# Altium project ESP32_DEV.PrjPcb
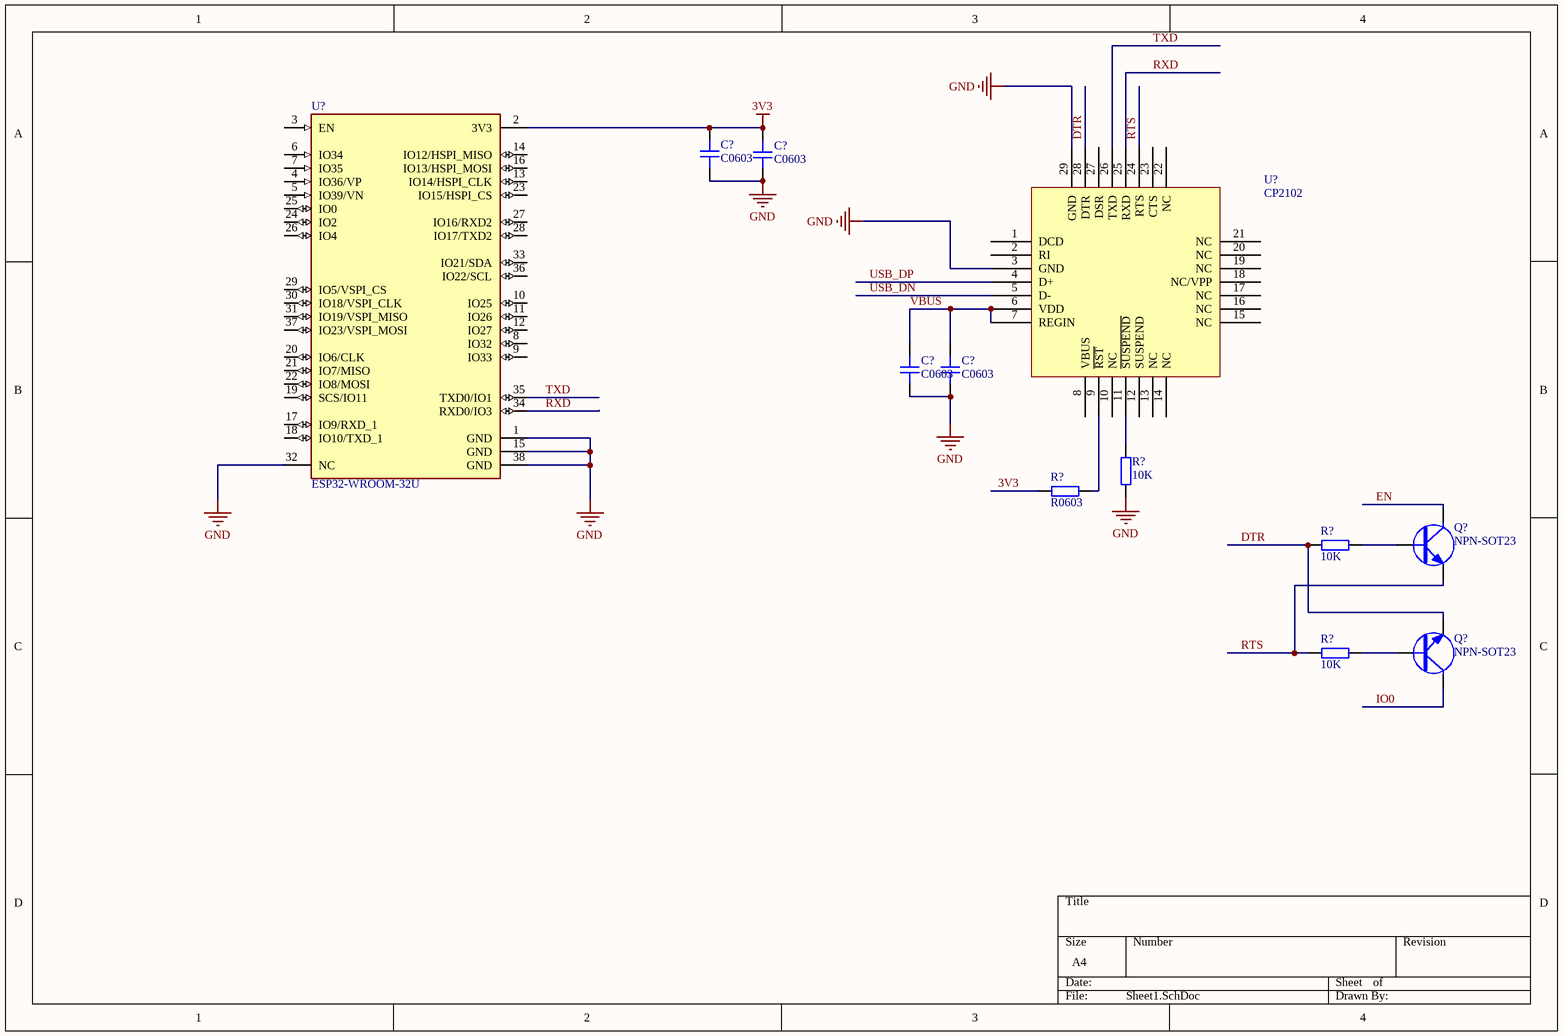
[diagram p0: Sheet1.SchDoc]
1 sheet, 12 parts. Net scope: global (net labels, ports and power ports of the same name join across sheets).
Board file: PCB1.PcbDoc

## Sheet Sheet1.SchDoc
size A4; SheetNumber: 1; SheetTotal: 1

### Parts
(Parts that share a designator on the sheet are numbered #1, #2 ... from top to bottom, then left to right.)
C?#1  C0603  [CAP_0603]
C?#2  C0603  [CAP_0603]
C?#3  C0603  [CAP_0603]
C?#4  C0603  [CAP_0603]
Q?#1  NPN-SOT23  [SOT23 - 3PIN]
Q?#2  NPN-SOT23  [SOT23 - 3PIN]
R?#1  10K  [RES_0603]
R?#2  R0603  [RES_0603]
R?#3  10K  [RES_0603]
R?#4  10K  [RES_0603]
U?#1  CP2102  [QFN28]
U?#2  ESP32-WROOM-32U  [ESP32-WROOM-32U]

### Nets
3V3: C?#1.2 C?#2.2 R?#2.2 U?#2.2(3V3)
GND: C?#1.1 C?#2.1 C?#3.1 C?#4.1 R?#1.1 U?#1.3(GND) U?#1.29(GND) U?#2.1(GND) U?#2.15(GND) U?#2.32(NC) U?#2.38(GND)
DTR: Q?#2.2(E) R?#3.2 U?#1.28(DTR)
EN: Q?#1.3(C)
IO0: Q?#2.3(C)
RTS: Q?#1.2(E) R?#4.2 U?#1.24(RTS)
RXD: U?#1.25(RXD) U?#2.34(RXD0/IO3)
TXD: U?#1.26(TXD) U?#2.35(TXD0/IO1)
USB_DN: U?#1.5(D-)
USB_DP: U?#1.4(D+)
VBUS: C?#3.2 C?#4.2 U?#1.6(VDD) U?#1.7(REGIN)
NetQ?#1_1: Q?#1.1(B) R?#3.1
NetQ?#2_1: Q?#2.1(B) R?#4.1
NetR?#1_2: R?#1.2 U?#1.11(~{SUSPEND})
NetR?#2_1: R?#2.1 U?#1.9(~{RST})

Not connected (* = marked no-connect by the designer): U?#1 1(DCD) 2(RI) 8(VBUS) 10(NC) 12(SUSPEND) 13(NC) 14(NC) 15(NC) 16(NC) 17(NC) 18(NC/VPP) 19(NC) 20(NC) 21(NC) 22(NC) 23(CTS) 27(DSR); U?#2 3(EN) 4(IO36/VP) 5(IO39/VN) 6(IO34) 7(IO35) 8(IO32) 9(IO33) 10(IO25) 11(IO26) 12(IO27) 13(IO14/HSPI_CLK) 14(IO12/HSPI_MISO) 16(IO13/HSPI_MOSI) 17(IO9/RXD_1) 18(IO10/TXD_1) 19(SCS/IO11) 20(IO6/CLK) 21(IO7/MISO) 22(IO8/MOSI) 23(IO15/HSPI_CS) 24(IO2) 25(IO0) 26(IO4) 27(IO16/RXD2) 28(IO17/TXD2) 29(IO5/VSPI_CS) 30(IO18/VSPI_CLK) 31(IO19/VSPI_MISO) 33(IO21/SDA) 36(IO22/SCL) 37(IO23/VSPI_MOSI)

### Library data of the parts
C?#1-C?#4 = CAP_0603: Capacitor SMD 0603; Manufacturer: *; Manufacturer Part Number: *; Distributor Link: *; LCSC: *; Rating: *; Dielectric: *
R?#1-R?#4 = RES_0603: Resistor SMD 0603; Manufacturer: *; Manufacturer Part Number: *; Distributor Link: *; LCSC: *
U?#2 = ESP32-WROOM-32U: Bluetooth, WiFi 802.11b/g/n, Bluetooth v4.2 +EDR, Class 1, 2 and 3 Transceiver Module 2.4GHz ~ 2.5GHz Antenna Not Included, U.FL Surface Mount; MF: Espressif Systems; SnapEDA_Link: https://www.snapeda.com/parts/ESP32-WROOM-32U/Espressif+Systems/view-part/?ref=snap; Package: NON STANDARD-39 Espressif; Value: *; MP: ESP32-WROOM-32U; Check_prices: https://www.snapeda.com/parts/ESP32-WROOM-32U/Espressif+Systems/view-part/?ref=eda